# Altium schematic sheet 8860.SchDoc: 3V3 PSU
size A
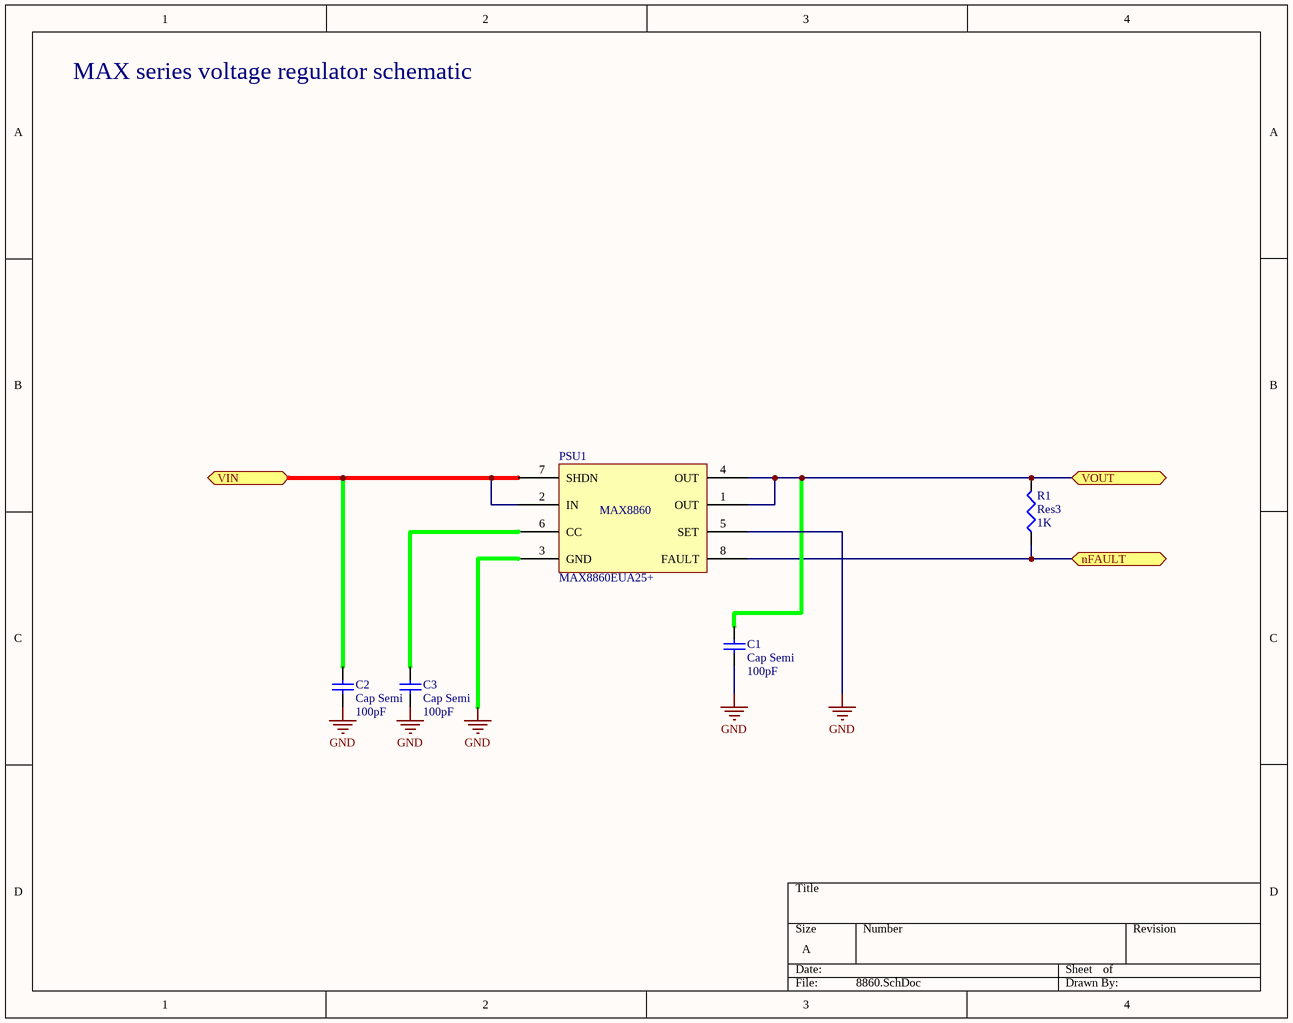
[diagram p0: 8860.SchDoc]

## Parts
C1  Cap Semi  value 100pF  [C1206]
C2  Cap Semi  value 100pF  [C1206]
C3  Cap Semi  value 100pF  [C1206]
PSU1  MAX8860EUA25+  [TSOP65P300X110-8N]
R1  Res3  value 1K  [14-1210]

## Ports
nFAULT, VIN, VOUT

## Nets
GND: C1.1 C2.1 C3.1 PSU1.3(GND) PSU1.5(SET)
nFAULT: PSU1.8(FAULT) R1.1 ; port nFAULT
VIN: C2.2 PSU1.2(IN) PSU1.7(SHDN) ; port VIN
VOUT: C1.2 PSU1.1(OUT) PSU1.4(OUT) R1.2 ; port VOUT
NetC3_2: C3.2 PSU1.6(CC)

## Notes on the sheet
- MAX series voltage regulator schematic
- (in symbol MAX8860EUA25+) MAX8860

## Library data of the parts
C1-C3 = Cap Semi: Capacitor (Semiconductor SIM Model); Published: 8-Jun-2000; LatestRevisionDate: 29-May-2009; LatestRevisionNote: IPC-7351 Footprint Added.; PackageReference: C1206; Publisher: Altium Limited; PackageDescription: Chip Capacitor
R1 = Res3: Resistor; Published: 8-Jun-2000; LatestRevisionDate: 29-May-2009; LatestRevisionNote: IPC-7351 Footprint Added.; PackageReference: J1-0603; Publisher: Altium Limited; PackageDescription: Chip Resistor